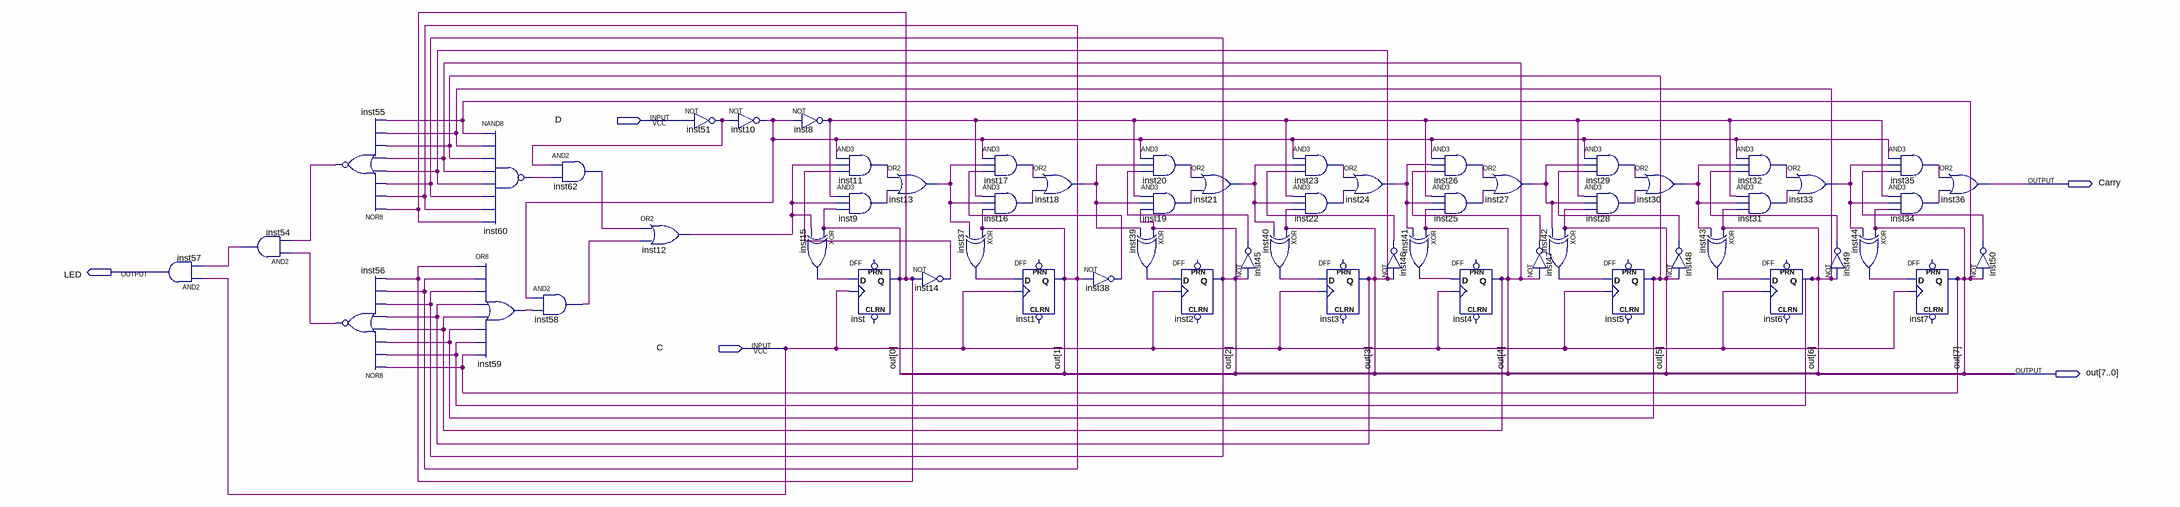
[diagram p0: schematic sheet]
// Quartus schematic contador_top.bdf as structural Verilog: 60 symbols, 5 pins
module contador_top (
  input  D,
  input  C,
  output Carry,
  output LED,
  output [7:0] out
);

  wire inst8_out, inst9_out, inst10_out, inst11_out, inst12_out, inst13_out, inst14_out, inst15_out,
       inst16_out, inst17_out, inst18_out, inst19_out, inst20_out, inst21_out, inst22_out, inst23_out,
       inst24_out, inst25_out, inst26_out, inst27_out, inst28_out, inst29_out, inst30_out, inst31_out,
       inst32_out, inst33_out, inst34_out, inst35_out, inst37_out, inst38_out, inst39_out, inst40_out,
       inst41_out, inst42_out, inst43_out, inst44_out, inst45_out, inst46_out, inst47_out, inst48_out,
       inst49_out, inst50_out, inst51_out, inst54_out, inst55_out, inst56_out, inst58_out, inst59_out,
       inst60_out, inst62_out;

  and inst57 (LED, C, inst54_out);
  and inst54 (inst54_out, inst56_out, inst55_out);
  nor inst55 (inst55_out, out[0], out[1], out[2], out[3], out[4], out[5], out[6], out[7]);
  nor inst56 (inst56_out, out[7], out[6], out[5], out[4], out[3], out[2], out[1], out[0]);
  nand inst60 (inst60_out, out[7], out[6], out[5], out[4], out[3], out[2], out[1], out[0]);
  or inst59 (inst59_out, out[0], out[1], out[2], out[3], out[4], out[5], out[6], out[7]);
  and inst58 (inst58_out, inst10_out, inst59_out);
  and inst62 (inst62_out, inst51_out, inst60_out);
  or inst12 (inst12_out, inst62_out, inst58_out);
  not inst51 (inst51_out, D);
  not inst10 (inst10_out, inst51_out);
  not inst8 (inst8_out, inst10_out);
  xor inst15 (inst15_out, out[0], inst12_out);
  and inst11 (inst11_out, inst10_out, inst12_out, inst14_out);
  and inst9 (inst9_out, inst8_out, inst12_out, out[0]);
  DFF inst (.CLK(C), .D(inst15_out), .Q(out[0]));  // open: CLRN, PRN
  or inst13 (inst13_out, inst11_out, inst9_out);
  not inst14 (inst14_out, out[0]);
  and inst17 (inst17_out, inst10_out, inst13_out, inst38_out);
  and inst16 (inst16_out, inst8_out, inst13_out, out[1]);
  xor inst37 (inst37_out, out[1], inst13_out);
  or inst18 (inst18_out, inst17_out, inst16_out);
  DFF inst1 (.CLK(C), .D(inst37_out), .Q(out[1]));  // open: CLRN, PRN
  not inst38 (inst38_out, out[1]);
  and inst20 (inst20_out, inst10_out, inst18_out, inst45_out);
  and inst19 (inst19_out, inst8_out, inst18_out, out[2]);
  xor inst39 (inst39_out, out[2], inst18_out);
  or inst21 (inst21_out, inst20_out, inst19_out);
  DFF inst2 (.CLK(C), .D(inst39_out), .Q(out[2]));  // open: CLRN, PRN
  not inst45 (inst45_out, out[2]);
  and inst23 (inst23_out, inst10_out, inst21_out, inst46_out);
  and inst22 (inst22_out, inst8_out, inst21_out, out[3]);
  xor inst40 (inst40_out, out[3], inst21_out);
  or inst24 (inst24_out, inst23_out, inst22_out);
  DFF inst3 (.CLK(C), .D(inst40_out), .Q(out[3]));  // open: CLRN, PRN
  xor inst41 (inst41_out, out[4], inst24_out);
  not inst46 (inst46_out, out[3]);
  and inst26 (inst26_out, inst10_out, inst24_out, inst47_out);
  and inst25 (inst25_out, inst8_out, inst24_out, out[4]);
  DFF inst4 (.CLK(C), .D(inst41_out), .Q(out[4]));  // open: CLRN, PRN
  or inst27 (inst27_out, inst26_out, inst25_out);
  xor inst42 (inst42_out, out[5], inst27_out);
  not inst47 (inst47_out, out[4]);
  and inst29 (inst29_out, inst10_out, inst27_out, inst48_out);
  and inst28 (inst28_out, inst8_out, inst27_out, out[5]);
  DFF inst5 (.CLK(C), .D(inst42_out), .Q(out[5]));  // open: CLRN, PRN
  or inst30 (inst30_out, inst29_out, inst28_out);
  xor inst43 (inst43_out, out[6], inst30_out);
  not inst48 (inst48_out, out[5]);
  and inst32 (inst32_out, inst10_out, inst30_out, inst49_out);
  and inst31 (inst31_out, inst8_out, inst30_out, out[6]);
  DFF inst6 (.CLK(C), .D(inst43_out), .Q(out[6]));  // open: CLRN, PRN
  or inst33 (inst33_out, inst32_out, inst31_out);
  xor inst44 (inst44_out, out[7], inst33_out);
  not inst49 (inst49_out, out[6]);
  and inst35 (inst35_out, inst10_out, inst33_out, inst50_out);
  and inst34 (inst34_out, inst8_out, inst33_out, out[7]);
  DFF inst7 (.CLK(C), .D(inst44_out), .Q(out[7]));  // open: CLRN, PRN
  or inst36 (Carry, inst35_out, inst34_out);
  not inst50 (inst50_out, out[7]);
endmodule
